# EAGLE schematic dmfboard (EAGLE 6.6.0)
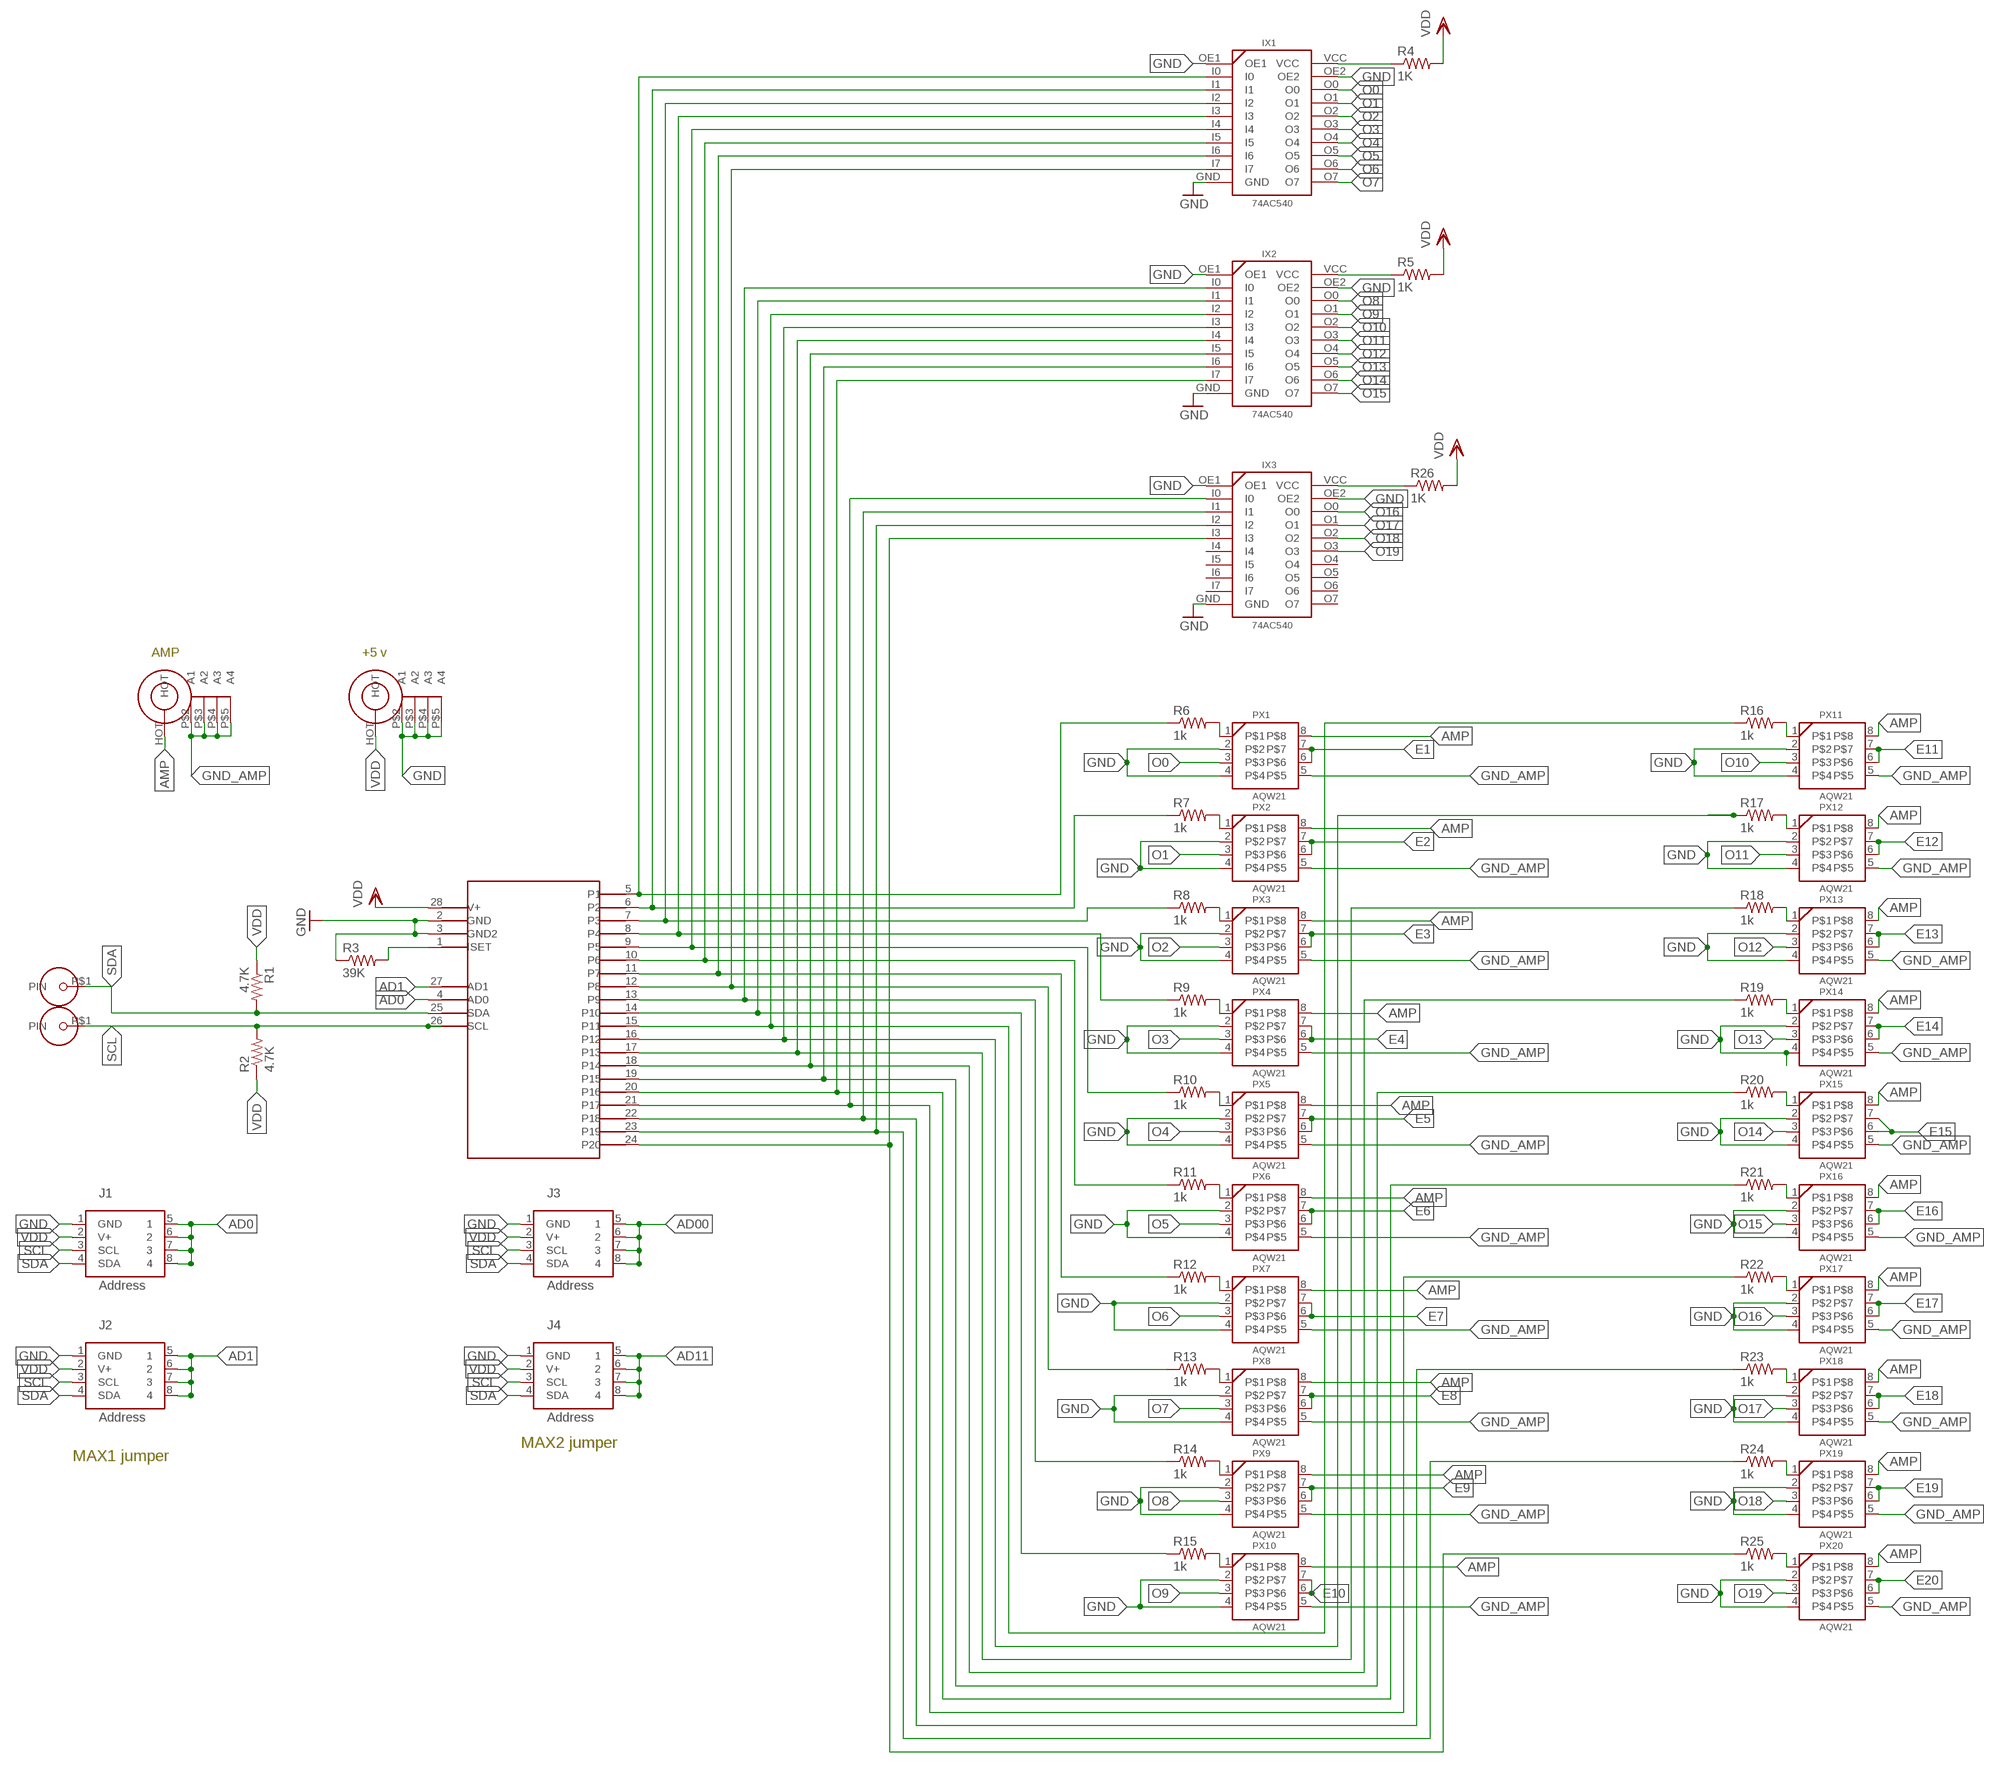
[diagram p0: schematic, sheet 1, part 1 of 2]
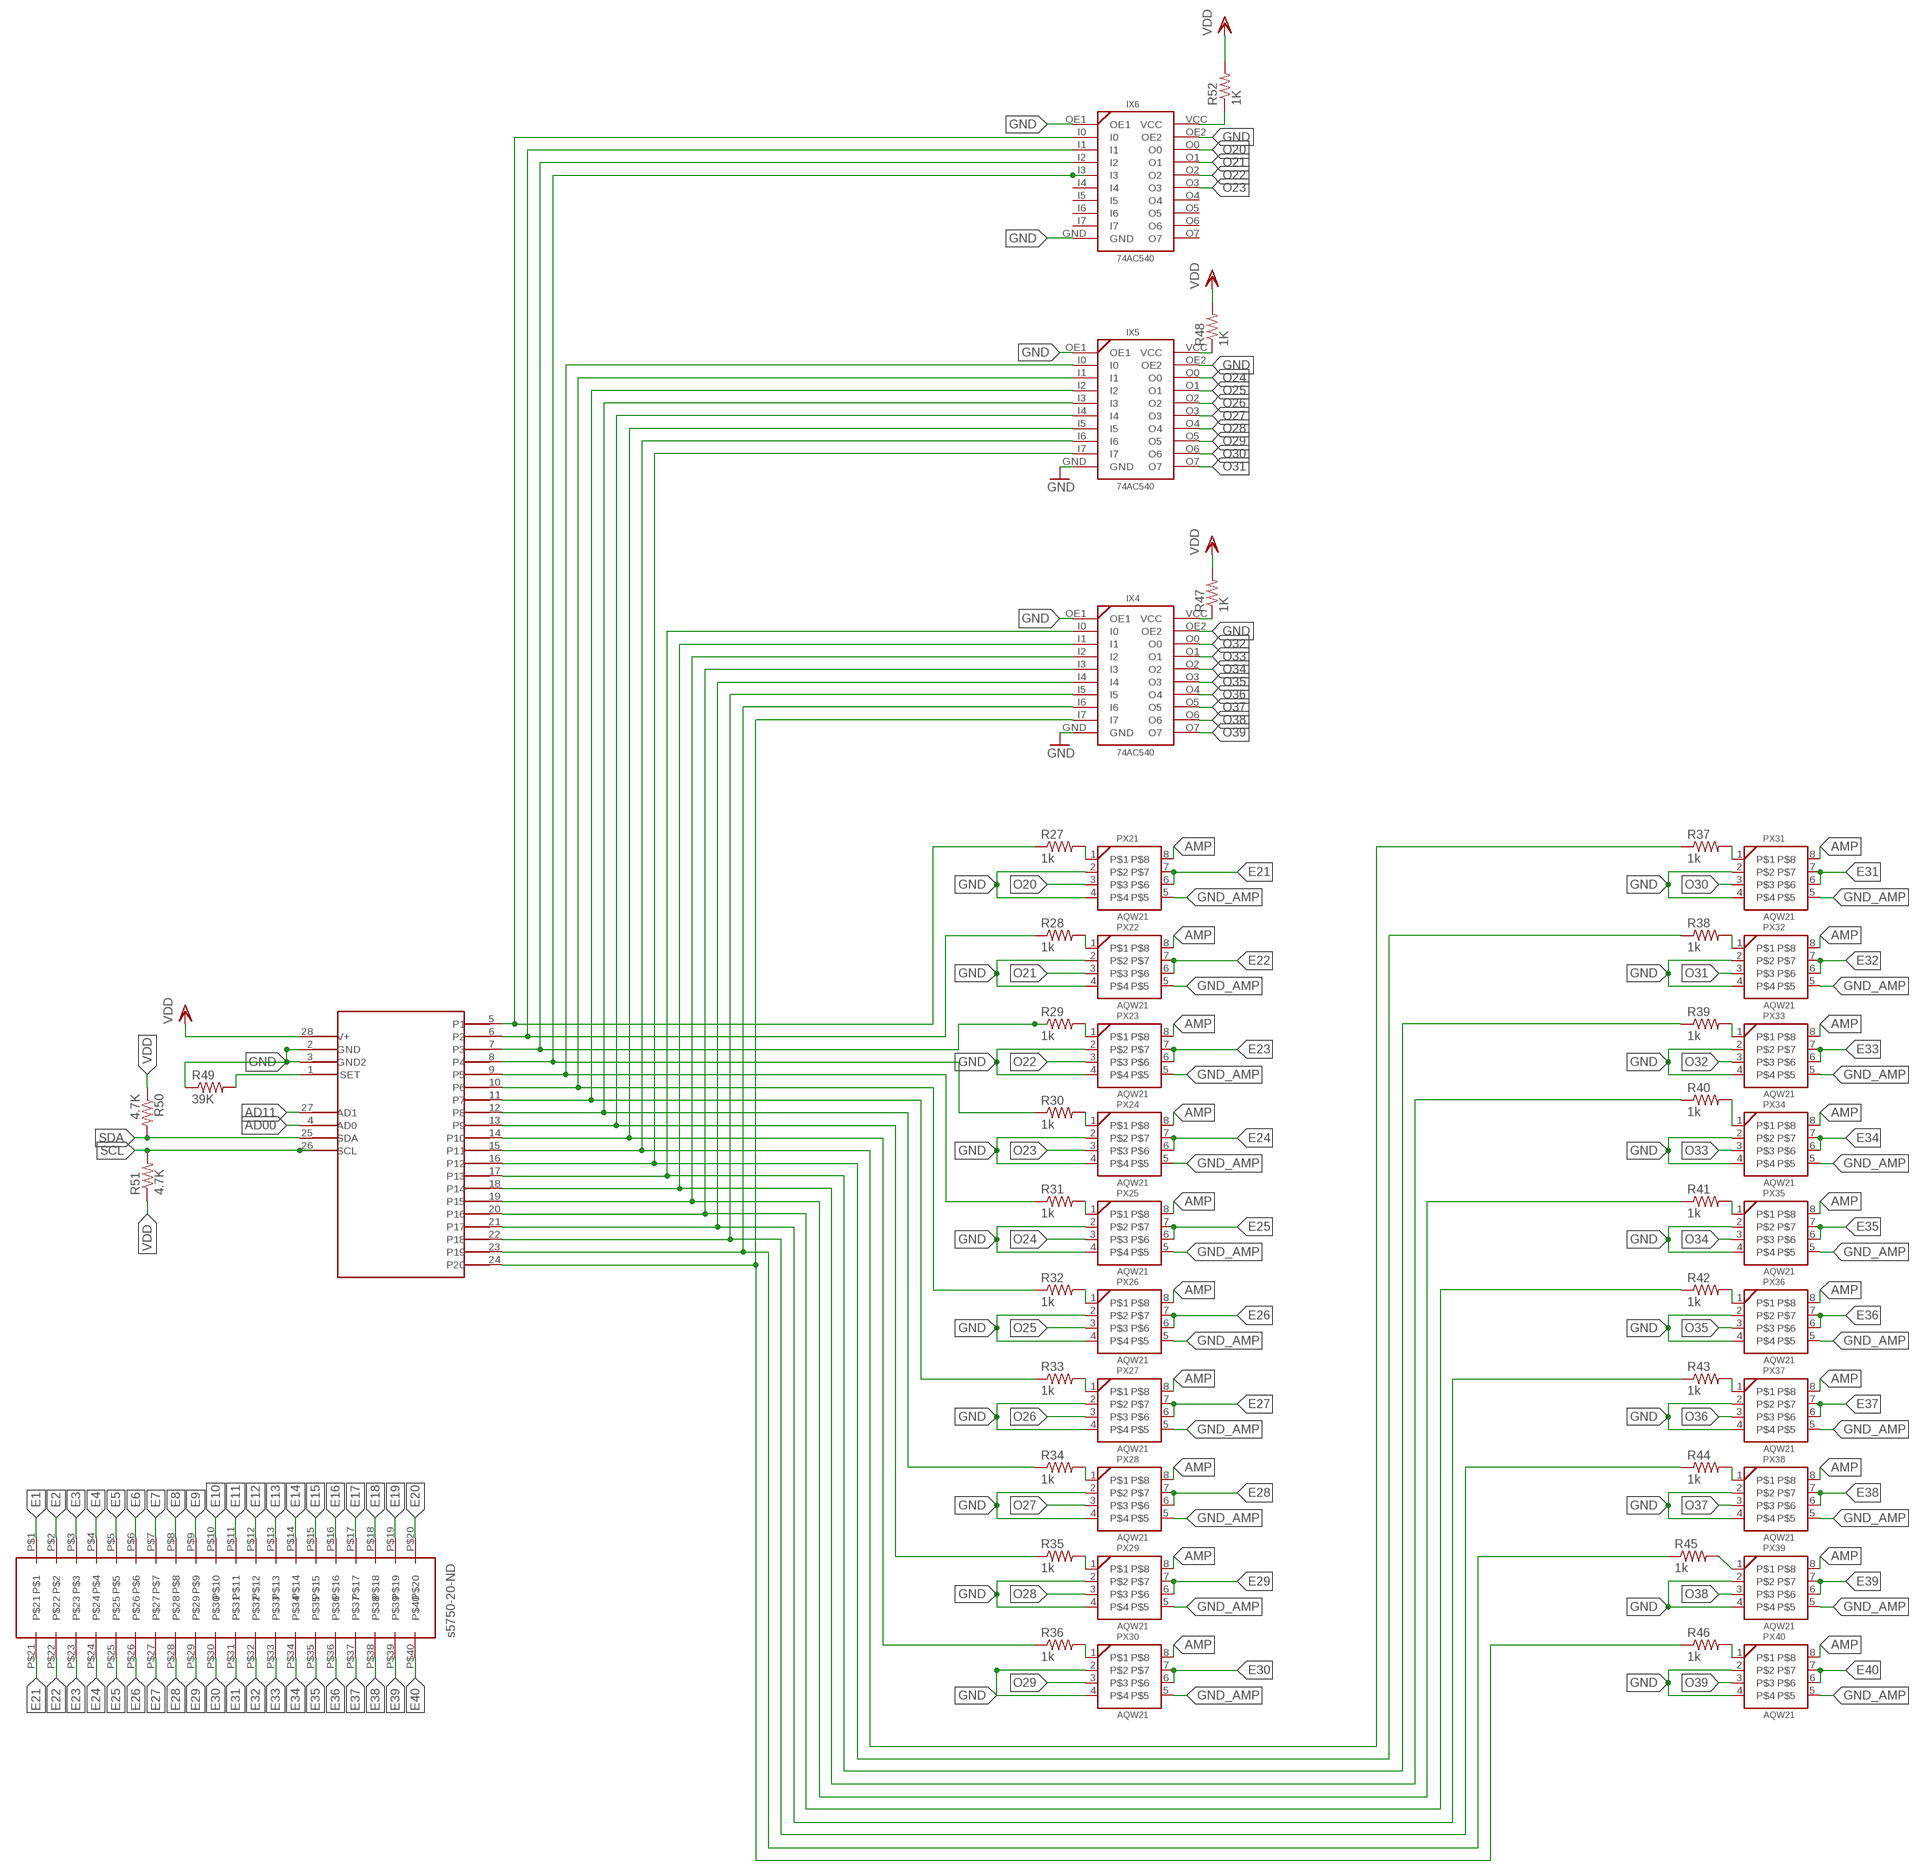
[diagram p1: schematic, sheet 1, part 2 of 2]

## Parts
5V  BNC-BNC  [BNC-BNC]
AMP  BNC-BNC  [BNC-BNC]
CONX1  S5750_20_ND40PIN_CONNECTOR  [S5750-20_ND]
IX1  74AC540  [SO20W]
IX2  74AC540  [SO20W]
IX3  74AC540  [SO20W]
IX4  74AC540  [SO20W]
IX5  74AC540  [SO20W]
IX6  74AC540  [SO20W]
J1  JUMPER  [JUMPER]
J2  JUMPER  [JUMPER]
J3  JUMPER  [JUMPER]
J4  JUMPER  [JUMPER]
MX1  MAX7300  [MAX7300]
MX2  MAX7300  [MAX7300]
PX1  AQW21  [AQW216EH]
PX2  AQW21  [AQW216EH]
PX3  AQW21  [AQW216EH]
PX4  AQW21  [AQW216EH]
PX5  AQW21  [AQW216EH]
PX6  AQW21  [AQW216EH]
PX7  AQW21  [AQW216EH]
PX8  AQW21  [AQW216EH]
PX9  AQW21  [AQW216EH]
PX10  AQW21  [AQW216EH]
PX11  AQW21  [AQW216EH]
PX12  AQW21  [AQW216EH]
PX13  AQW21  [AQW216EH]
PX14  AQW21  [AQW216EH]
PX15  AQW21  [AQW216EH]
PX16  AQW21  [AQW216EH]
PX17  AQW21  [AQW216EH]
PX18  AQW21  [AQW216EH]
PX19  AQW21  [AQW216EH]
PX20  AQW21  [AQW216EH]
PX21  AQW21  [AQW216EH]
PX22  AQW21  [AQW216EH]
PX23  AQW21  [AQW216EH]
PX24  AQW21  [AQW216EH]
PX25  AQW21  [AQW216EH]
PX26  AQW21  [AQW216EH]
PX27  AQW21  [AQW216EH]
PX28  AQW21  [AQW216EH]
PX29  AQW21  [AQW216EH]
PX30  AQW21  [AQW216EH]
PX31  AQW21  [AQW216EH]
PX32  AQW21  [AQW216EH]
PX33  AQW21  [AQW216EH]
PX34  AQW21  [AQW216EH]
PX35  AQW21  [AQW216EH]
PX36  AQW21  [AQW216EH]
PX37  AQW21  [AQW216EH]
PX38  AQW21  [AQW216EH]
PX39  AQW21  [AQW216EH]
PX40  AQW21  [AQW216EH]
R1  4.7K  R-US_M0805  [M0805]
R2  4.7K  R-US_M0805  [M0805]
R3  39K  R-US_M0805  [M0805]
R4  1K  R-US_M0805  [M0805]
R5  1K  R-US_M0805  [M0805]
R6  1k  R-US_M0805  [M0805]
R7  1k  R-US_M0805  [M0805]
R8  1k  R-US_M0805  [M0805]
R9  1k  R-US_M0805  [M0805]
R10  1k  R-US_M0805  [M0805]
R11  1k  R-US_M0805  [M0805]
R12  1k  R-US_M0805  [M0805]
R13  1k  R-US_M0805  [M0805]
R14  1k  R-US_M0805  [M0805]
R15  1k  R-US_M0805  [M0805]
R16  1k  R-US_M0805  [M0805]
R17  1k  R-US_M0805  [M0805]
R18  1k  R-US_M0805  [M0805]
R19  1k  R-US_M0805  [M0805]
R20  1k  R-US_M0805  [M0805]
R21  1k  R-US_M0805  [M0805]
R22  1k  R-US_M0805  [M0805]
R23  1k  R-US_M0805  [M0805]
R24  1k  R-US_M0805  [M0805]
R25  1k  R-US_M0805  [M0805]
R26  1K  R-US_M0805  [M0805]
R27  1k  R-US_M0805  [M0805]
R28  1k  R-US_M0805  [M0805]
R29  1k  R-US_M0805  [M0805]
R30  1k  R-US_M0805  [M0805]
R31  1k  R-US_M0805  [M0805]
R32  1k  R-US_M0805  [M0805]
R33  1k  R-US_M0805  [M0805]
R34  1k  R-US_M0805  [M0805]
R35  1k  R-US_M0805  [M0805]
R36  1k  R-US_M0805  [M0805]
R37  1k  R-US_M0805  [M0805]
R38  1k  R-US_M0805  [M0805]
R39  1k  R-US_M0805  [M0805]
R40  1k  R-US_M0805  [M0805]
R41  1k  R-US_M0805  [M0805]
R42  1k  R-US_M0805  [M0805]
R43  1k  R-US_M0805  [M0805]
R44  1k  R-US_M0805  [M0805]
R45  1k  R-US_M0805  [M0805]
R46  1k  R-US_M0805  [M0805]
R47  1K  R-US_M0805  [M0805]
R48  1K  R-US_M0805  [M0805]
R49  39K  R-US_M0805  [M0805]
R50  4.7K  R-US_M0805  [M0805]
R51  4.7K  R-US_M0805  [M0805]
R52  1K  R-US_M0805  [M0805]
SCL  TH_HOLE  [TH_PIN]
SDA  TH_HOLE  [TH_PIN]

## Nets
AD00: J3.5 J3.6 J3.7 J3.8 MX2.4(AD0)
AD0: J1.5 J1.6 J1.7 J1.8 MX1.4(AD0)
AD1: J2.5 J2.6 J2.7 J2.8 MX1.27(AD1)
AD11: J4.5 J4.6 J4.7 J4.8 MX2.27(AD1)
AMP [AMP]: AMP.HOT PX1.8 PX2.8 PX3.8 PX4.8 PX5.8 PX6.8 PX7.8 PX8.8 PX9.8 PX10.8 PX11.8 PX12.8 PX13.8 PX14.8 PX15.8 PX16.8 PX17.8 PX18.8 PX19.8 PX20.8 PX21.8 PX22.8 PX23.8 PX24.8 PX25.8 PX26.8 PX27.8 PX28.8 PX29.8 PX30.8 PX31.8 PX32.8 PX33.8 PX34.8 PX35.8 PX36.8 PX37.8 PX38.8 PX39.8 PX40.8
E1: CONX1.P$1 PX1.6 PX1.7
E2: CONX1.P$2 PX2.6 PX2.7
E3: CONX1.P$3 PX3.6 PX3.7
E4: CONX1.P$4 PX4.6 PX4.7
E5: CONX1.P$5 PX5.6 PX5.7
E6: CONX1.P$6 PX6.6 PX6.7
E7: CONX1.P$7 PX7.6 PX7.7
E8: CONX1.P$8 PX8.6 PX8.7
E9: CONX1.P$9 PX9.6 PX9.7
E10: CONX1.P$10 PX10.6 PX10.7
E11: CONX1.P$11 PX11.6 PX11.7
E12: CONX1.P$12 PX12.6 PX12.7
E13: CONX1.P$13 PX13.6 PX13.7
E14: CONX1.P$14 PX14.6 PX14.7
E15: CONX1.P$15 PX15.6 PX15.7
E16: CONX1.P$16 PX16.6 PX16.7
E17: CONX1.P$17 PX17.6 PX17.7
E18: CONX1.P$18 PX18.6 PX18.7
E19: CONX1.P$19 PX19.6 PX19.7
E20: CONX1.P$20 PX20.6 PX20.7
E21: CONX1.P$21 PX21.6 PX21.7
E22: CONX1.P$22 PX22.6 PX22.7
E23: CONX1.P$23 PX23.6 PX23.7
E24: CONX1.P$24 PX24.6 PX24.7
E25: CONX1.P$25 PX25.6 PX25.7
E26: CONX1.P$26 PX26.6 PX26.7
E27: CONX1.P$27 PX27.6 PX27.7
E28: CONX1.P$28 PX28.6 PX28.7
E29: CONX1.P$29 PX29.6 PX29.7
E30: CONX1.P$30 PX30.6 PX30.7
E31: CONX1.P$31 PX31.6 PX31.7
E32: CONX1.P$32 PX32.6 PX32.7
E33: CONX1.P$33 PX33.6 PX33.7
E34: CONX1.P$34 PX34.6 PX34.7
E35: CONX1.P$35 PX35.6 PX35.7
E36: CONX1.P$36 PX36.6 PX36.7
E37: CONX1.P$37 PX37.6 PX37.7
E38: CONX1.P$38 PX38.6 PX38.7
E39: CONX1.P$39 PX39.6 PX39.7
E40: CONX1.P$40 PX40.6 PX40.7
GND: 5V.P$2(A1) 5V.P$3(A2) 5V.P$4(A3) 5V.P$5(A4) IX1.GND IX1.OE1 IX1.OE2 IX2.GND IX2.OE1 IX2.OE2 IX3.GND IX3.OE1 IX3.OE2 IX4.GND IX4.OE1 IX4.OE2 IX5.GND IX5.OE1 IX5.OE2 IX6.GND IX6.OE1 IX6.OE2 J1.1(GND) J2.1(GND) J3.1(GND) J4.1(GND) MX1.2(GND) MX1.3(GND2) MX2.2(GND) MX2.3(GND2) PX1.2 PX1.4 PX2.2 PX2.4 PX3.2 PX3.4 PX4.2 PX4.4 PX5.2 PX5.4 PX6.2 PX6.4 PX7.2 PX7.4 PX8.2 PX8.4 PX9.2 PX9.4 PX10.2 PX10.4 PX11.2 PX11.4 PX12.2 PX12.4 PX13.2 PX13.4 PX14.2 PX14.4 PX15.2 PX15.4 PX16.2 PX16.4 PX17.2 PX17.4 PX18.2 PX18.4 PX19.2 PX19.4 PX20.2 PX20.4 PX21.2 PX21.4 PX22.2 PX22.4 PX23.2 PX23.4 PX24.2 PX24.4 PX25.2 PX25.4 PX26.2 PX26.4 PX27.2 PX27.4 PX28.2 PX28.4 PX29.2 PX29.4 PX30.2 PX30.4 PX31.2 PX31.4 PX32.2 PX32.4 PX33.2 PX33.4 PX34.2 PX34.4 PX35.2 PX35.4 PX36.2 PX36.4 PX37.2 PX37.4 PX38.2 PX38.4 PX39.2 PX39.4 PX40.2 PX40.4 R3.1 R49.1
GND_AMP: AMP.P$2(A1) AMP.P$3(A2) AMP.P$4(A3) AMP.P$5(A4) PX1.5 PX2.5 PX3.5 PX4.5 PX5.5 PX6.5 PX7.5 PX8.5 PX9.5 PX10.5 PX11.5 PX12.5 PX13.5 PX14.5 PX15.5 PX16.5 PX17.5 PX18.5 PX19.5 PX20.5 PX21.5 PX22.5 PX23.5 PX24.5 PX25.5 PX26.5 PX27.5 PX28.5 PX29.5 PX30.5 PX31.5 PX32.5 PX33.5 PX34.5 PX35.5 PX36.5 PX37.5 PX38.5 PX39.5 PX40.5
N$1: MX2.1(ISET) R49.2
N$2: MX1.1(ISET) R3.2
N$3: IX1.VCC R4.1
N$4: IX2.VCC R5.1
N$5: IX3.VCC R26.1
N$6: IX4.VCC R47.1
N$7: IX5.VCC R48.1
N$8: IX6.VCC R52.1
N$11: IX4.I1 MX2.18(P14) R40.1
N$18: IX5.I7 MX2.16(P12) R38.1
N$28: PX10.1 R15.2
N$29: PX9.1 R14.2
N$30: PX8.1 R13.2
N$31: PX7.1 R12.2
N$32: PX6.1 R11.2
N$33: PX5.1 R10.2
N$34: PX4.1 R9.2
N$35: PX3.1 R8.2
N$36: PX2.1 R7.2
N$37: PX1.1 R6.2
N$38: PX11.1 R16.2
N$39: PX12.1 R17.2
N$40: PX13.1 R18.2
N$41: PX14.1 R19.2
N$42: PX15.1 R20.2
N$43: PX16.1 R21.2
N$44: PX17.1 R22.2
N$45: PX18.1 R23.2
N$46: PX19.1 R24.2
N$47: PX20.1 R25.2
N$48: IX1.I0 MX1.5(P1) R6.1
N$50: IX1.I2 MX1.7(P3) R8.1
N$51: IX1.I3 MX1.8(P4) R9.1
N$52: IX1.I4 MX1.9(P5) R10.1
N$53: IX1.I5 MX1.10(P6) R11.1
N$54: IX1.I6 MX1.11(P7) R12.1
N$55: IX1.I7 MX1.12(P8) R13.1
N$56: IX2.I0 MX1.13(P9) R14.1
N$57: IX2.I1 MX1.14(P10) R15.1
N$58: IX2.I2 MX1.15(P11) R16.1
N$59: IX2.I3 MX1.16(P12) R17.1
N$60: IX2.I4 MX1.17(P13) R18.1
N$61: IX2.I5 MX1.18(P14) R19.1
N$62: IX2.I6 MX1.19(P15) R20.1
N$63: IX2.I7 MX1.20(P16) R21.1
N$64: IX3.I0 MX1.21(P17) R22.1
N$65: IX3.I1 MX1.22(P18) R23.1
N$66: IX3.I2 MX1.23(P19) R24.1
N$67: IX3.I3 MX1.24(P20) R25.1
N$68: IX1.I1 MX1.6(P2) R7.1
N$82: PX21.1 R27.2
N$83: PX22.1 R28.2
N$84: PX23.1 R29.2
N$85: PX24.1 R30.2
N$86: PX25.1 R31.2
N$87: PX26.1 R32.2
N$88: PX27.1 R33.2
N$89: PX28.1 R34.2
N$90: PX29.1 R35.2
N$91: PX30.1 R36.2
N$92: IX5.I0 MX2.9(P5) R31.1
N$103: PX31.1 R37.2
N$104: PX32.1 R38.2
N$105: PX33.1 R39.2
N$106: PX34.1 R40.2
N$107: PX35.1 R41.2
N$108: PX36.1 R42.2
N$109: PX37.1 R43.2
N$110: PX38.1 R44.2
N$111: PX39.1 R45.2
N$112: PX40.1 R46.2
N$114: IX5.I1 MX2.10(P6) R32.1
N$115: IX5.I2 MX2.11(P7) R33.1
N$116: IX5.I3 MX2.12(P8) R34.1
N$117: IX5.I4 MX2.13(P9) R35.1
N$118: IX5.I5 MX2.14(P10) R36.1
N$119: IX5.I6 MX2.15(P11) R37.1
N$120: IX4.I2 MX2.19(P15) R41.1
N$121: IX4.I0 MX2.17(P13) R39.1
N$123: IX4.I3 MX2.20(P16) R42.1
N$124: IX4.I4 MX2.21(P17) R43.1
N$125: IX4.I5 MX2.22(P18) R44.1
N$126: IX4.I6 MX2.23(P19) R45.1
N$127: IX4.I7 MX2.24(P20) R46.1
N$128: IX6.I0 MX2.5(P1) R27.1
N$129: IX6.I1 MX2.6(P2) R28.1
N$130: IX6.I2 MX2.7(P3) R29.1
N$131: IX6.I3 MX2.8(P4) R30.1
O0: IX1.O0 PX1.3
O1: IX1.O1 PX2.3
O2: IX1.O2 PX3.3
O3: IX1.O3 PX4.3
O4: IX1.O4 PX5.3
O5: IX1.O5 PX6.3
O6: IX1.O6 PX7.3
O7: IX1.O7 PX8.3
O8: IX2.O0 PX9.3
O9: IX2.O1 PX10.3
O10: IX2.O2 PX11.3
O11: IX2.O3 PX12.3
O12: IX2.O4 PX13.3
O13: IX2.O5 PX14.3
O14: IX2.O6 PX15.3
O15: IX2.O7 PX16.3
O16: IX3.O0 PX17.3
O17: IX3.O1 PX18.3
O18: IX3.O2 PX19.3
O19: IX3.O3 PX20.3
O20: IX6.O0 PX21.3
O21: IX6.O1 PX22.3
O22: IX6.O2 PX23.3
O23: IX6.O3 PX24.3
O24: IX5.O0 PX25.3
O25: IX5.O1 PX26.3
O26: IX5.O2 PX27.3
O27: IX5.O3 PX28.3
O28: IX5.O4 PX29.3
O29: IX5.O5 PX30.3
O30: IX5.O6 PX31.3
O31: IX5.O7 PX32.3
O32: IX4.O0 PX33.3
O33: IX4.O1 PX34.3
O34: IX4.O2 PX35.3
O35: IX4.O3 PX36.3
O36: IX4.O4 PX37.3
O37: IX4.O5 PX38.3
O38: IX4.O6 PX39.3
O39: IX4.O7 PX40.3
SCL: J1.3(SCL) J2.3(SCL) J3.3(SCL) J4.3(SCL) MX1.26(SCL) MX2.26(SCL) R2.2 R51.2 SCL.P$1(PIN)
SDA: J1.4(SDA) J2.4(SDA) J3.4(SDA) J4.4(SDA) MX1.25(SDA) MX2.25(SDA) R1.2 R50.2 SDA.P$1(PIN)
VDD: 5V.HOT J1.2(V+) J2.2(V+) J3.2(V+) J4.2(V+) MX1.28(V+) MX2.28(V+) R1.1 R2.1 R4.2 R5.2 R26.2 R47.2 R48.2 R50.1 R51.1 R52.2
Unconnected: IX3.I4 IX3.I5 IX3.I6 IX3.I7 IX3.O4 IX3.O5 IX3.O6 IX3.O7 IX6.I4 IX6.I5 IX6.I6 IX6.I7 IX6.O4 IX6.O5 IX6.O6 IX6.O7

## Notes on the sheet
- AMP | +5 v
- MAX2 jumper
- MAX1 jumper

## Library data of the parts
5V AMP = DMFlib:BNC-BNC
CONX1 = DMFlib:S5750_20_ND40PIN_CONNECTOR
IX1-IX6 = DMFlib:74AC540
J1-J4 = DMFlib:JUMPER
MX1 MX2 = DMFlib:MAX7300
PX1-PX40 = DMFlib:AQW21
R1-R52 = resistor:R-US_: RESISTOR, American symbol
SCL SDA = DMFlib:TH_HOLE

## Net classes
0 default: width 0.178 mm
1 AMP: width 0.178 mm, clearance 1.016 mm